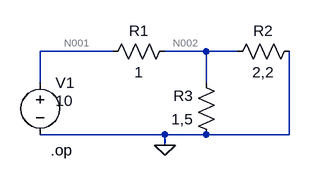
[diagram p0: schematic Draft3.asc]
Draft3.asc, the LTspice schematic file:
Version 4
SHEET 1 880 680
WIRE 176 64 64 64
WIRE 320 64 256 64
WIRE 368 64 320 64
WIRE 64 112 64 64
WIRE 320 112 320 64
WIRE 256 192 64 192
WIRE 320 192 256 192
WIRE 448 192 448 64
WIRE 448 192 320 192
WIRE 256 208 256 192
FLAG 256 208 0
SYMBOL voltage 64 96 R0
WINDOW 3 24 44 Left 2
WINDOW 123 0 0 Left 0
WINDOW 39 0 0 Left 0
SYMATTR InstName V1
SYMATTR Value 10
SYMBOL res 272 48 R90
WINDOW 0 0 56 VBottom 2
WINDOW 3 32 56 VTop 2
SYMATTR InstName R1
SYMATTR Value 1
SYMBOL res 464 48 R90
WINDOW 0 0 56 VBottom 2
WINDOW 3 32 56 VTop 2
SYMATTR InstName R2
SYMATTR Value 2,2
SYMBOL res 336 208 R180
WINDOW 0 36 76 Left 2
WINDOW 3 36 40 Left 2
SYMATTR InstName R3
SYMATTR Value 1,5
TEXT 80 216 Left 2 !.op

The netlist it stands for:
* Draft3.asc
V1 N001 0 10
R1 N002 N001 1
R2 0 N002 2,2
R3 0 N002 1,5
.op
.backanno
.end

* Results of the author's LTspice run, read from the files saved beside the schematic
* Operating Point:
*   V(n001) = 10 V
*   V(n002) = 5.882 V
*   I(R1) = -4.118 A
*   I(R2) = -2.941 A
*   I(R3) = -1.176 A
*   I(V1) = -4.118 A